# Altium schematic sheet P1.schdoc
size 420 x 297 mm; Symbol: Sheet-Symbol_A3; Company: 嘉立创EDA; Version: V1.0; Page Size: A3; @Project Name: alpakka_qk; @Page Count: 1; @Update Date: 2026-02-22; @Create Date: 2026-02-22; @Schematic Name: Schematic2; @Page No: 1; @Page Name: P1; Device: Sheet-Symbol_A3; Border: 1; Title Block Position: 3; Width: 1655; Height: 1170; Region Start: 1; X Region Count: 6; Y Region Count: 4; Blade Width: 10; Title Block: 1; @Board Name: Board1; @Create Time: 18:07:49; @Update Time: 18:07:49
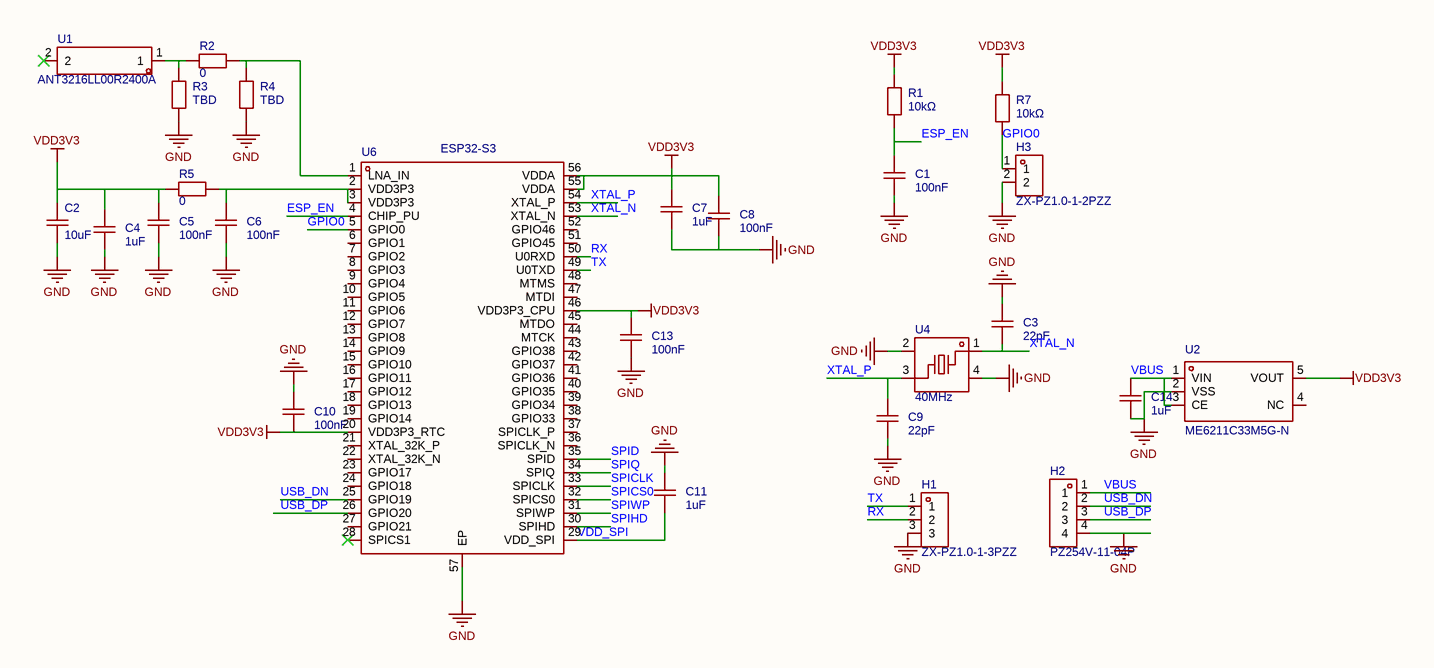
[diagram p0: P1.schdoc]

## Parts
C1  100nF  [C0201]
C2  10uF  [C0402]
C3  22pF  [C0201]
C4  1uF  [C0201]
C5  100nF  [C0201]
C6  100nF  [C0201]
C7  1uF  [C0201]
C8  100nF  [C0201]
C9  22pF  [C0201]
C10  100nF  [C0201]
C11  1uF  [C0201]
C13  100nF  [C0201]
C14  1uF  [C0201]
H1  ZX-PZ1.0-1-3PZZ  [HDR-TH_3P-P1.00-V-M-3]
H2  PZ254V-11-04P  [HDR-TH_4P-P2.54-V-M]
H3  ZX-PZ1.0-1-2PZZ  [HDR-TH_2P-P1.00-V-M]
R1  10kΩ  [R0201]
R2  0  [R0201]
R3  TBD  [R0201]
R4  TBD  [R0201]
R5  0  [R0201]
R7  10kΩ  [R0201]
U1  ANT3216LL00R2400A  [ANT-SMD_L3.2-W1.6]
U2  ME6211C33M5G-N  [SOT-23-5_L3.0-W1.7-P0.95-LS2.8-BL]
U4  40MHz  [CRYSTAL-SMD_4P-L2.0-W1.6-BL]
U6  ESP32-S3  [QFN-56_L7.0-W7.0-P0.40-TL-EP4.0]

## Nets
GND: C1.1 C2.1 C3.2 C4.1 C5.1 C6.1 C7.1 C8.1 C9.1 C10.1 C11.2 C13.1 C14.1 H1.3 H2.4 H3.2 R3.1 R4.1 U2.2(VSS) U4.2(GND) U4.4(GND) U6.57(EP)
VDD3V3: C2.2 C4.2 C5.2 C7.2 C8.2 C10.2 C13.2 R1.2 R5.2 R7.1 U2.5(VOUT) U6.20(VDD3P3_RTC) U6.46(VDD3P3_CPU) U6.55(VDDA) U6.56(VDDA)
ESP_EN: C1.2 R1.1 U6.4(CHIP_PU)
GPIO0: H3.1 R7.2 U6.5(GPIO0)
RX: H1.2 U6.50(U0RXD)
SPICLK: U6.33(SPICLK)
SPICS0: U6.32(SPICS0)
SPID: U6.35(SPID)
SPIHD: U6.30(SPIHD)
SPIQ: U6.34(SPIQ)
SPIWP: U6.31(SPIWP)
TX: H1.1 U6.49(U0TXD)
USB_DN: H2.2 U6.25(GPIO19)
USB_DP: H2.3 U6.26(GPIO20)
VBUS: C14.2 H2.1 U2.1(VIN) U2.3(CE)
VDD_SPI: C11.1 U6.29(VDD_SPI)
XTAL_N: C3.1 U4.1 U6.53(XTAL_N)
XTAL_P: C9.2 U4.3 U6.54(XTAL_P)
NetC6_2: C6.2 R5.1 U6.2(VDD3P3) U6.3(VDD3P3)
NetR2_1: R2.1 R4.2 U6.1(LNA_IN)
NetR2_2: R2.2 R3.2 U1.1

Not connected (* = marked no-connect by the designer): U1 2*; U2 4(NC); U6 6(GPIO1) 7(GPIO2) 8(GPIO3) 9(GPIO4) 10(GPIO5) 11(GPIO6) 12(GPIO7) 13(GPIO8) 14(GPIO9) 15(GPIO10) 16(GPIO11) 17(GPIO12) 18(GPIO13) 19(GPIO14) 21(XTAL_32K_P) 22(XTAL_32K_N) 23(GPIO17) 24(GPIO18) 27(GPIO21) 28(SPICS1)* 36(SPICLK_N) 37(SPICLK_P) 38(GPIO33) 39(GPIO34) 40(GPIO35) 41(GPIO36) 42(GPIO37) 43(GPIO38) 44(MTCK) 45(MTDO) 47(MTDI) 48(MTMS) 51(GPIO45) 52(GPIO46)

## Notes on the sheet
- 更新日期
- 2026-02-22
- 原理图
- 图页
- Schematic2
- P1
- 创建日期
- 物料编码
- 审阅
- 绘制
- alpakka_qk
- 版本
- V1.0
- 尺寸
- A3
- 页
- 1
- 嘉立创EDA
- 共

## Library data of the parts
C1 C5 C6 C8 C10 C13 = GRM033R61E104KE14D: 容值:100nF;精度:±10%;额定电压:25V;温度系数:X5R;; Manufacturer: muRata(村田); AddInBom: yes; ModelId: e8033a7cb35143ffb28e3b81b2577ea00819f05c4eef4c71ace90d822a990e87; ModelName: C0201_L0.6-W0.3-H0.3; ModelTransform: 23.622,11.811,0,0,0,0,0,0,0; Tolerance: ±10%; Voltage Rating: 25V; Temperature Coefficient: X5R; Symbol: GRM033R61E104KE14D; Device: GRM033R61E104KE14D; LCSC Part Name: 100nF ±10% 25V; SupplierPart: C76939; ManufacturerPart: GRM033R61E104KE14D; Supplier Footprint: 0201; JLCPCB Part Class: Extended Part; Datasheet: https://item.szlcsc.com/datasheet/GRM033R61E104KE14D/78066.html; Supplier: LCSC; ConvertToPcb: yes; FootprintName: C0201; Value: 100nF
C2 = CL05A106MQ5NUNC: 容值:10uF;精度:±20%;额定电压:6.3V;材质(温度系数):X5R;; Manufacturer: SAMSUNG(三星); 3D Model: 36a51122f27c49738f86b3bfa98863e0; 3D Model Transform: 39.37,19.685,0,0,0,0,0,0,0; Tolerance: ±20%; Voltage Rated: 6.3V; Temperature Coefficient: X5R; AddInBom: yes; ModelName: C0402_L1.0-W0.5-H0.5; Symbol: CL05A106MQ5NUNC; Device: CL05A106MQ5NUNC; Value: 10uF; LCSC Part Name: 10uF ±20% 6.3V; Supplier Part: C15525; Manufacturer Part: CL05A106MQ5NUNC; Supplier Footprint: 0402; JLCPCB Part Class: 基础库; Datasheet: https://atta.szlcsc.com/upload/public/pdf/source/20220823/2B02EE04F8F211D38A52DCB16EB6BEBA.pdf; Supplier: LCSC; ConvertToPcb: yes; FootprintName: C0402
C3 C9 = GRM0335C1H220JA01D: 容值:22pF;精度:±5%;额定电压:50V;材质(温度系数):C0G;; Manufacturer: muRata(村田); AddInBom: yes; ModelId: e8033a7cb35143ffb28e3b81b2577ea00819f05c4eef4c71ace90d822a990e87; ModelName: C0201_L0.6-W0.3-H0.3; ModelTransform: 23.622,11.811,0,0,0,0,0,0,0; Tolerance: ±5%; Voltage Rated: 50V; Temperature Coefficient: C0G; Symbol: GRM0335C1H220JA01D; Device: GRM0335C1H220JA01D; LCSC Part Name: 22pF ±5% 50V; SupplierPart: C76924; ManufacturerPart: GRM0335C1H220JA01D; Supplier Footprint: 0201; JLCPCB Part Class: Extended Part; Datasheet: https://atta.szlcsc.com/upload/public/pdf/source/20180307/C76924_15204090903111407714.pdf; Supplier: LCSC; ConvertToPcb: yes; FootprintName: C0201; Value: 22pF
C4 C7 C11 = GRM033R61A105ME44D: 容值:1uF;精度:±20%;额定电压:10V;温度系数:X5R;; Manufacturer: muRata(村田); AddInBom: yes; ModelId: e8033a7cb35143ffb28e3b81b2577ea00819f05c4eef4c71ace90d822a990e87; ModelName: C0201_L0.6-W0.3-H0.3; ModelTransform: 23.622,11.811,0,0,0,0,0,0,0; Tolerance: ±20%; Voltage Rating: 10V; Temperature Coefficient: X5R; Symbol: GRM033R61A105ME44D; Device: GRM033R61A105ME44D; LCSC Part Name: 1uF ±20% 10V; SupplierPart: C76935; ManufacturerPart: GRM033R61A105ME44D; Supplier Footprint: 0201; JLCPCB Part Class: Extended Part; Datasheet: https://item.szlcsc.com/datasheet/GRM033R61A105ME44D/78062.html; Supplier: LCSC; ConvertToPcb: yes; FootprintName: C0201; Value: 1uF
C14 = GRM033R61A105ME44D: 容值:1uF;精度:±20%;额定电压:10V;温度系数:X5R;; Manufacturer: muRata(村田); 3D Model: e8033a7cb35143ffb28e3b81b2577ea00819f05c4eef4c71ace90d822a990e87; 3D Model Transform: 23.622,11.811,0,0,0,0,0,0,0; Tolerance: ±20%; Voltage Rating: 10V; Temperature Coefficient: X5R; AddInBom: yes; ModelName: C0201_L0.6-W0.3-H0.3; Symbol: GRM033R61A105ME44D; Device: GRM033R61A105ME44D; LCSC Part Name: 1uF ±20% 10V; Supplier Part: C76935; Manufacturer Part: GRM033R61A105ME44D; Supplier Footprint: 0201; JLCPCB Part Class: Extended Part; Datasheet: https://item.szlcsc.com/datasheet/GRM033R61A105ME44D/78062.html; Supplier: LCSC; Value: 1uF; ConvertToPcb: yes; FootprintName: C0201
H1 = ZX-PZ1.0-1-3PZZ: 插针结构:1x3P;间距:1mm;行距:-;圆针/方针:方针;安装方式:直插;排数:单排;总PIN位数:3P;额定电流:750mA;配合针长度:2mm;塑高:1mm;端接针长度:2mm;触头材质:黄铜;触头镀层:金;工作温度:-40℃~+105℃;颜色:黑色;; Manufacturer: Megastar(兆星); 3D Model: 6f6203f6db8b4f489789f9ab3199bf84; 3D Model Transform: 118.5037,59.055,0,0,0,0,0,0,-78.74; Pin Structure: 1x3P; Pitch: 1mm; Circluar Pins/Square Pins: 方针; Current Rating: 750mA; AddInBom: yes; Symbol: ZX-PZ1.0-1-3PZZ; Device: ZX-PZ1.0-1-3PZZ; LCSC Part Name: 1x3P 间距:1mm 方针 直插; Supplier Part: C37328853; Manufacturer Part: ZX-PZ1.0-1-3PZZ; Supplier Footprint: 插件,P=1mm; JLCPCB Part Class: 扩展库; Datasheet: https://atta.szlcsc.com/upload/public/pdf/source/20240812/85F48A99F7C6AED78605DAA33CDE8A90.pdf; Supplier: LCSC; Row Spacing: -; Mounting Type: 直插; Number of Rows: 单排; Number of Pins: 3P; Length of Mating Pin: 2mm; Insulation Height: 1mm; Length of End Connection Pin: 2mm; Contact Material: 黄铜; Contact Plating: 金; Operating Temperature: -40℃~+105℃; Color: 黑色; ConvertToPcb: yes; FootprintName: HDR-TH_3P-P1.00-V-M-3; ModelName: HDR-TH_3P-P1.00-V-M-3
H2 = PZ254V-11-04P: 插针结构:1x4P;间距:2.54mm;行距:-;圆针/方针:方针;安装方式:直插;排数:单排;总PIN位数:4P;额定电流:3A;额定电压:250V;配合针长度:6mm;塑高:2.5mm;端接针长度:3mm;触头材质:-;工作温度:-40℃~+105℃;颜色:黑色;; Manufacturer: XFCN(兴飞); Symbol: PZ254V-11-04P_C2691448; AddInBom: yes; ModelId: 112f4d05e8d64e99ab9a333894bea4f90819f05c4eef4c71ace90d822a990e87; ModelName: HDR-TH_4P-P2.54-M-LI-1X4P; ModelTransform: 399.999,104.7242,0,0,0,0,0,0,-118.11; Pin Structure: 1x4P; Pitch: 2.54mm; Circluar Pins/Square Pins: 方针; Current Rating: 3A; Voltage Rating (Max): 250V; Device: PZ254V-11-04P; LCSC Part Name: 1x4P 间距:2.54mm 方针 直插; SupplierPart: C2691448; ManufacturerPart: PZ254V-11-04P; Supplier Footprint: 插件,P=2.54mm; JLCPCB Part Class: Extended Part; Datasheet: https://item.szlcsc.com/datasheet/PZ254V-11-04P/2801085.html; Supplier: LCSC; ConvertToPcb: yes; FootprintName: HDR-TH_4P-P2.54-V-M; Row Spacing: -; Mounting Type: 直插; Number of Rows: 单排; Number of Pins: 4P; Length of Mating Pin: 6mm; Insulation Height: 2.5mm; Length of End Connection Pin: 3mm; Contact Material: -; Operating Temperature: -40℃~+105℃; Color: 黑色
H3 = ZX-PZ1.0-1-2PZZ: 插针结构:1x2P;间距:1mm;行距:-;圆针/方针:方针;安装方式:直插;排数:单排;总PIN位数:2P;额定电流:750mA;额定电压:-;配合针长度:2mm;塑高:1mm;端接针长度:2mm;触头材质:黄铜;触头镀层:金;工作温度:-40℃~+105℃;颜色:黑色;; Manufacturer: Megastar(兆星); 3D Model: 2c607178eddd4e0fa976400e673561890819f05c4eef4c71ace90d822a990e87; 3D Model Transform: 90.59037,50,0,0,0,0,0,0,-70.866; Pin Structure: 1x2P; Pitch: 1mm; Circluar Pins/Square Pins: 方针; Current Rating: 750mA; AddInBom: yes; Symbol: ZX-PZ1.0-1-2PZZ; Device: ZX-PZ1.0-1-2PZZ; LCSC Part Name: 1x2P 间距:1mm 方针 直插; Supplier Part: C37328852; Manufacturer Part: ZX-PZ1.0-1-2PZZ; Supplier Footprint: 插件,P=1mm; JLCPCB Part Class: Extended Part; Datasheet: https://item.szlcsc.com/datasheet/ZX-PZ1.0-1-2PZZ/39053333.html; Supplier: LCSC; Row Spacing: -; Mounting Type: 直插; Number of Rows: 单排; Number of Pins: 2P; Voltage Rating (Max): -; Length of Mating Pin: 2mm; Insulation Height: 1mm; Length of End Connection Pin: 2mm; Contact Material: 黄铜; Contact Plating: 金; Operating Temperature: -40℃~+105℃; Color: 黑色; ConvertToPcb: yes; FootprintName: HDR-TH_2P-P1.00-V-M; ModelName: HDR-TH_2P-P1.00-V-M
R1 = FRC0201J103 TS: 电阻类型:厚膜电阻;阻值:10kΩ;精度:±5%;功率:50mW;温度系数:±200ppm/℃;; Manufacturer: FOJAN(富捷); AddInBom: yes; ModelId: 0e006ba4c37b4b73b0e85d5d1c6800cb0819f05c4eef4c71ace90d822a990e87; ModelName: R0201_L0.6-W0.3-H0.3; ModelTransform: 23.622,11.811,0,0,0,0,0,-0.0005,0; Tolerance: ±5%; Power(Watts): 50mW; Symbol: FRC0201J103 TS; Device: FRC0201J103 TS; LCSC Part Name: 厚膜电阻 10kΩ ±5% 50mW; SupplierPart: C7467266; ManufacturerPart: FRC0201J103 TS; Supplier Footprint: 0201; JLCPCB Part Class: Extended Part; Datasheet: https://item.szlcsc.com/datasheet/FRC0201J103%2520TS/8513882.html; Supplier: LCSC; ConvertToPcb: yes; FootprintName: R0201; Type: 厚膜电阻; Value: 10kΩ; Temperature Coefficient: ±200ppm/℃
R2-R4 = 0201WMF0000TEE: 电阻类型:厚膜电阻;阻值:0Ω;精度:±1%;功率:50mW;工作电压:25V;温度系数:-;; Manufacturer: UNI-ROYAL(厚声); AddInBom: yes; ModelId: 0e006ba4c37b4b73b0e85d5d1c6800cb0819f05c4eef4c71ace90d822a990e87; ModelName: R0201_L0.6-W0.3-H0.3; ModelTransform: 23.622,11.811,0,0,0,0,0,-0.0005,0; Tolerance: ±1%; Power(Watts): 50mW; Voltage-Supply(Max): 25V; Symbol: 0201WMF0000TEE; Device: 0201WMF0000TEE; LCSC Part Name: 0Ω ±1% 50mW 厚膜电阻; ManufacturerPart: 0201WMF0000TEE; Supplier Footprint: 0201; JLCPCB Part Class: Extended Part; Datasheet: https://item.szlcsc.com/datasheet/0201WMF0000TEE/479866.html; Supplier: LCSC; ConvertToPcb: yes; FootprintName: R0201; Type: 厚膜电阻; Temperature Coefficient: -; Operating Temperature: -55℃~+155℃
  R2: Value: 0
  R3 R4: Value: TBD
R5 = 0201WMF0000TEE: 电阻类型:厚膜电阻;阻值:0Ω;精度:±1%;功率:50mW;工作电压:25V;温度系数:-;; Manufacturer: UNI-ROYAL(厚声); 3D Model: 0e006ba4c37b4b73b0e85d5d1c6800cb0819f05c4eef4c71ace90d822a990e87; 3D Model Transform: 23.622,11.811,0,0,0,0,0,-0.0005,0; Tolerance: ±1%; Power(Watts): 50mW; Voltage-Supply(Max): 25V; AddInBom: yes; ModelName: R0201_L0.6-W0.3-H0.3; Symbol: 0201WMF0000TEE; Device: 0201WMF0000TEE; Value: 0; LCSC Part Name: 0Ω ±1% 50mW 厚膜电阻; Manufacturer Part: 0201WMF0000TEE; Supplier Footprint: 0201; JLCPCB Part Class: Extended Part; Datasheet: https://item.szlcsc.com/datasheet/0201WMF0000TEE/479866.html; Supplier: LCSC; Type: 厚膜电阻; Temperature Coefficient: -; Operating Temperature: -55℃~+155℃; ConvertToPcb: yes; FootprintName: R0201
R7 = FRC0201J103 TS: 电阻类型:厚膜电阻;阻值:10kΩ;精度:±5%;功率:50mW;温度系数:±200ppm/℃;; Manufacturer: FOJAN(富捷); 3D Model: 0e006ba4c37b4b73b0e85d5d1c6800cb0819f05c4eef4c71ace90d822a990e87; 3D Model Transform: 23.622,11.811,0,0,0,0,0,-0.0005,0; Tolerance: ±5%; Power(Watts): 50mW; AddInBom: yes; ModelName: R0201_L0.6-W0.3-H0.3; Symbol: FRC0201J103 TS; Device: FRC0201J103 TS; LCSC Part Name: 厚膜电阻 10kΩ ±5% 50mW; Supplier Part: C7467266; Manufacturer Part: FRC0201J103 TS; Supplier Footprint: 0201; JLCPCB Part Class: Extended Part; Datasheet: https://item.szlcsc.com/datasheet/FRC0201J103%2520TS/8513882.html; Supplier: LCSC; Type: 厚膜电阻; Value: 10kΩ; Temperature Coefficient: ±200ppm/℃; ConvertToPcb: yes; FootprintName: R0201
U1 = ANT3216LL00R2400A: 2.4 - 2.5 GHz; Manufacturer: YAGEO(国巨); 3D Model: 7eb3a33db31f44a1a017d8a4ace7a401; 3D Model Transform: 126,63,0,180,0,0,0,0,0; AddInBom: yes; ModelName: ANT-SMD_L3.2-W1.6-H1.3; Symbol: ANT3216LL00R2400A; Device: ANT3216LL00R2400A; Manufacturer Part: ANT3216LL00R2400A; LCSC Part Name: ANT3216LL00R2400A; Supplier Part: C293767; Supplier Footprint: 1206; JLCPCB Part Class: 扩展库; Datasheet: https://atta.szlcsc.com/upload/public/pdf/source/20181012/C293767_CDE82A2F74DC82A94DB708CB53B68F23.pdf; Supplier: LCSC; ConvertToPcb: yes; FootprintName: ANT-SMD_L3.2-W1.6
U2 = ME6211C33M5G-N: 输出类型:固定;工作电压:6V;输出电压:3.3V;输出电流:500mA;电源纹波抑制比(PSRR):70dB@(1kHz);输出极性:正极;; Manufacturer: MICRONE(南京微盟); AddInBom: yes; ModelId: 0a2a1b8f50944f73965918ad6e5fe1670819f05c4eef4c71ace90d822a990e87; ModelName: SOT-23-5_L2.9-W1.6-H1.1-LS2.8-P0.95; ModelTransform: 118.60433,114.173,0,90,0,0,0.0005,0.0005,0; Output Type: 固定; Voltage - Supply: 6V; Output Voltage: 3.3V; Output Current: 500mA; Voltage Dropout: 120mV@(100mA); standby current: 60uA; Noise: 50uVrms; Output Configuration: 正极; Number of Outputs: 1; Symbol: ME6211C33M5G-N; Device: ME6211C33M5G-N; LCSC Part Name: 输入6V 输出3.3V 500mA; SupplierPart: C82942; ManufacturerPart: ME6211C33M5G-N; Supplier Footprint: SOT-23-5; JLCPCB Part Class: Extended Part; Datasheet: https://item.szlcsc.com/datasheet/ME6211C33M5G-N/84106.html; Supplier: LCSC; ConvertToPcb: yes; FootprintName: SOT-23-5_L3.0-W1.7-P0.95-LS2.8-BL; Power Supply Rejection Ratio (PSRR): 70dB@(1kHz); Features: 过流保护；带使能；短路保护; Operating Temperature: -40℃~+150℃
U4 = TAXM40M4ZHBCDT2T: 晶振类型:贴片晶振;频率:40MHz;常温频差:±10ppm;负载电容:15pF;频率稳定度:±20ppm;; Manufacturer: YJX(雅晶鑫); AddInBom: yes; ModelId: 5d2c7f6d96ec4dd1b062bb930f1f4d300819f05c4eef4c71ace90d822a990e87; ModelTransform: 80.709,64.961,0,0,0,0,0,0,0; Normal temperature Frequency Tolerance: ±10ppm; Load Capacitance: 15pF; Frequency Stability: ±20ppm; Equivalent Series Resistance(ESR): 40Ω; Symbol: TAXM40M4ZHBCDT2T; Device: TAXM40M4ZHBCDT2T; LCSC Part Name: 40MHz ±10ppm 15pF; SupplierPart: C424432; ManufacturerPart: TAXM40M4ZHBCDT2T; Supplier Footprint: SMD2016-4P; JLCPCB Part Class: Extended Part; Datasheet: https://item.szlcsc.com/datasheet/TAXM40M4ZHBCDT2T/417823.html; Supplier: LCSC; ConvertToPcb: yes; FootprintName: CRYSTAL-SMD_4P-L2.0-W1.6-BL; ModelName: CRYSTAL-SMD_4P-L2.0-W1.6-BL; Type: 贴片晶振; Value: 40MHz; Operating Temperature: -40℃~+85℃
U6 = ESP32-S3: Manufacturer: ESPRESSIF 乐鑫; Check: false; 3D Model: 105b388c0c03439aa7dbf35dd2b762a6; 3D Model Transform: 275.59,275.59,0,0,0,0,0,0,0; AddInBom: yes; Symbol: ESP32-S3; Device: ESP32-S3; LCSC Part Name: ESP32-S3; Supplier Part: C2913192; Manufacturer Part: ESP32-S3; Supplier Footprint: QFN56(7x7); JLCPCB Part Class: 扩展库; Datasheet: https://atta.szlcsc.com/upload/public/pdf/source/20220211/8CA5C1C53CA8E3D1871752073201D38A.pdf; Supplier: LCSC; ConvertToPcb: yes; FootprintName: QFN-56_L7.0-W7.0-P0.40-TL-EP4.0; ModelName: QFN-56_L7.0-W7.0-P0.40-TL-EP4.0